# EAGLE design PCB (EAGLE 7.6.0)
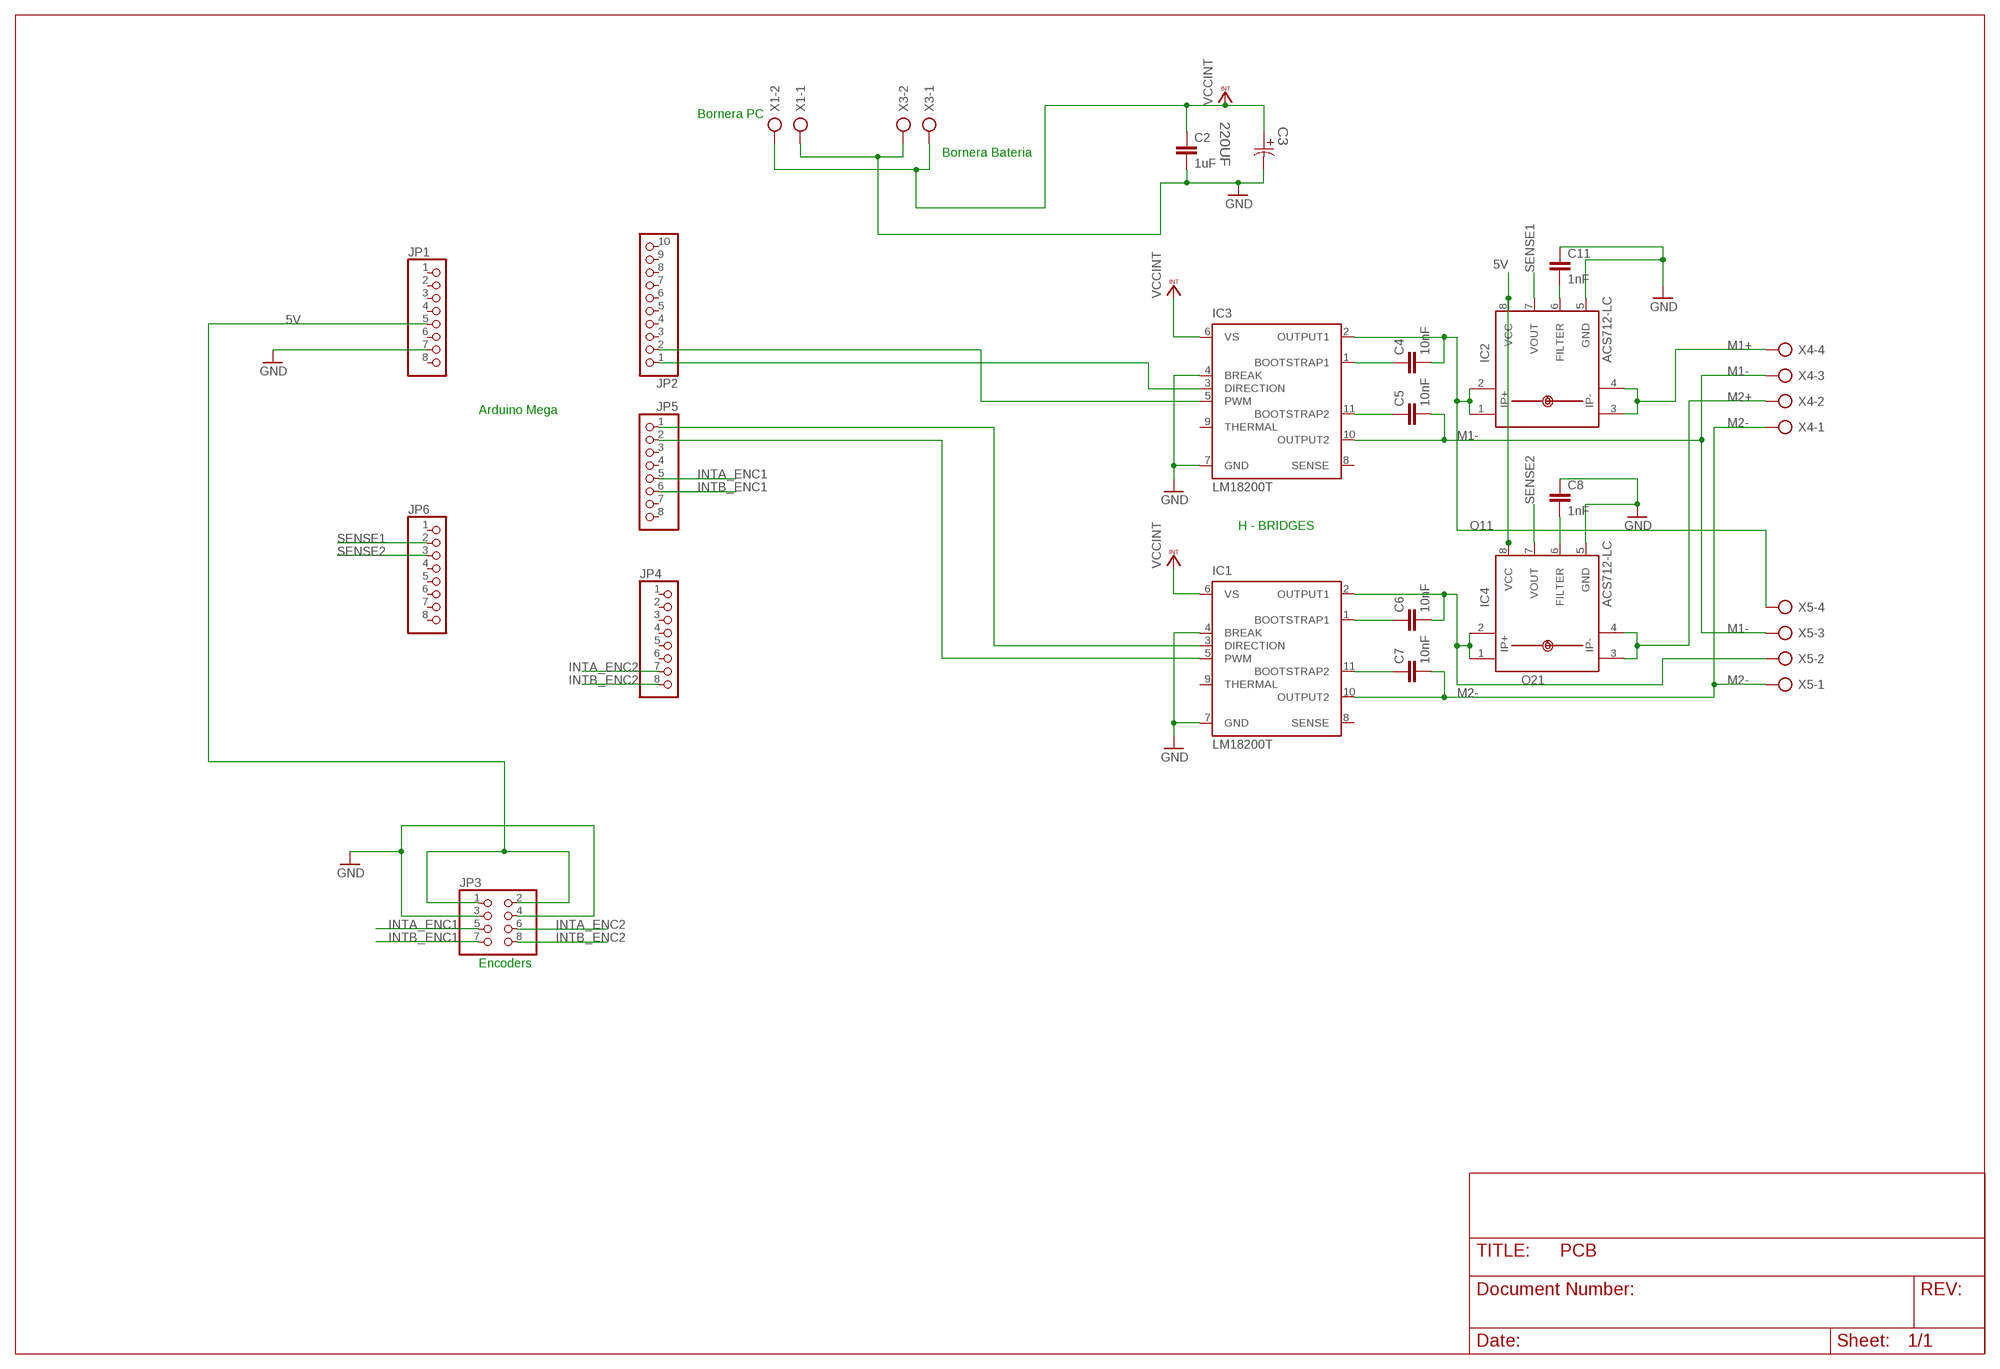
[diagram p0: schematic, sheet 1]

## Parts
C2  1uF  C-EU050-030X075  [C050-030X075]
C3  220UF  EEUFM1H221-P5.0-D10  [CAPPR500-1000X3200]
C4  10nF  C-EU050-030X075  [C050-030X075]
C5  10nF  C-EU050-030X075  [C050-030X075]
C6  10nF  C-EU050-030X075  [C050-030X075]
C7  10nF  C-EU050-030X075  [C050-030X075]
C8  1nF  C-EU050-030X075  [C050-030X075]
C11  1nF  C-EU050-030X075  [C050-030X075]
IC1  LM18200T  [TO-220-11]
IC2  ACS712-LC  [SOIC8]
IC3  LM18200T  [TO-220-11]
IC4  ACS712-LC  [SOIC8]
JP1  PINHD-1X8  [1X08]
JP2  PINHD-1X10  [1X10]
JP3  PINHD-2X4  [2X04]
JP4  PINHD-1X8  [1X08]
JP5  PINHD-1X8  [1X08]
JP6  PINHD-1X8  [1X08]
X1  AK500/2  [AK500/2]
X3  AK500/2  [AK500/2]
X4  AK500/4-H  [AK500/4-H]
X5  AK500/4-H  [AK500/4-H]

## Nets
5V: IC2.8(VCC) IC4.8(VCC) JP1.5 JP3.1 JP3.2
GND: C2.2 C3.2 C8.1 C11.1 IC1.4(BREAK) IC1.7(GND) IC2.5(GND) IC3.4(BREAK) IC3.7(GND) IC4.5(GND) JP1.7 JP3.3 JP3.4 X1.1 X3.2
INTA_ENC1: JP3.5 JP5.5
INTA_ENC2: JP3.6 JP4.7
INTB_ENC1: JP3.7 JP5.6
INTB_ENC2: JP3.8 JP4.8
M1+: IC2.3(IP-) IC2.4(IP-1) X4.4
M1-: C5.2 IC3.10(OUTPUT2) X4.3 X5.3
M2+: IC4.3(IP-) IC4.4(IP-1) X4.2
M2-: C7.2 IC1.10(OUTPUT2) X4.1 X5.1
N$1: IC3.3(DIRECTION) JP2.1
N$2: IC3.5(PWM) JP2.2
N$3: IC1.3(DIRECTION) JP5.1
N$4: C4.1 IC3.1(BOOTSTRAP1)
N$5: IC1.5(PWM) JP5.2
N$6: C8.2 IC4.6(FILTER)
N$13: C11.2 IC2.6(FILTER)
N$31: C5.1 IC3.11(BOOTSTRAP2)
N$32: C6.1 IC1.1(BOOTSTRAP1)
N$34: C7.1 IC1.11(BOOTSTRAP2)
O11: C4.2 IC2.1(IP+) IC2.2(IP+1) IC3.2(OUTPUT1) X5.4
O21: C6.2 IC1.2(OUTPUT1) IC4.1(IP+) IC4.2(IP+1) X5.2
SENSE1: IC2.7(VOUT) JP6.2
SENSE2: IC4.7(VOUT) JP6.3
VCCINT: C2.1 C3.1 IC1.6(VS) IC3.6(VS) X1.2 X3.1
Unconnected: IC1.8(SENSE) IC1.9(THERMAL) IC3.8(SENSE) IC3.9(THERMAL) JP1.1 JP1.2 JP1.3 JP1.4 JP1.6 JP1.8 JP2.3 JP2.4 JP2.5 JP2.6 JP2.7 JP2.8 JP2.9 JP2.10 JP4.1 JP4.2 JP4.3 JP4.4 JP4.5 JP4.6 JP5.3 JP5.4 JP5.7 JP5.8 JP6.1 JP6.4 JP6.5 JP6.6 JP6.7 JP6.8

## Notes on the sheet
- Bornera PC
- Bornera Bateria
- Arduino Mega
- H - BRIDGES
- Encoders

## Library data of the parts
C2 C4-C8 C11 = rcl:C-EU: CAPACITOR, European symbol
C3 = Panasonic-EE3:EEU: Aluminum Electrolytic Capacitors; MPN: EEUFM1H221; OC_FARNELL: 1219481; OC_NEWARK: 04M9023; RATEDVOLTAGE: 50V; SUPPLIER: PANASONIC; TOLERANCE: ±20 %
IC1 IC3 = national-semiconductor:LM18200T: 3A, 55V H-Bridge Motor Control SourcE: http://cache.national.com/ds/LM/LMD18200.pdf; OC_FARNELL: unknown; OC_NEWARK: unknown
IC2 IC4 = allegro-2:ACS712-LC
JP1 JP4-JP6 = pinhead:PINHD-1X8: PIN HEADER
JP2 = pinhead:PINHD-1X10: PIN HEADER
JP3 = pinhead:PINHD-2X4: PIN HEADER
X1 X3 = con-ptr500:AK500/2: CONNECTOR; OC_FARNELL: unknown; OC_NEWARK: unknown
X4 X5 = con-ptr500:AK500/4-H: CONNECTOR Aug. 2004 / PTR Meßtechnik: Die Bezeichnung der Serie AK505 wurde geändert. Es handelt sich hierbei um AK500 in horizontaler Ausführung.; OC_FARNELL: unknown; OC_NEWARK: unknown

## Board
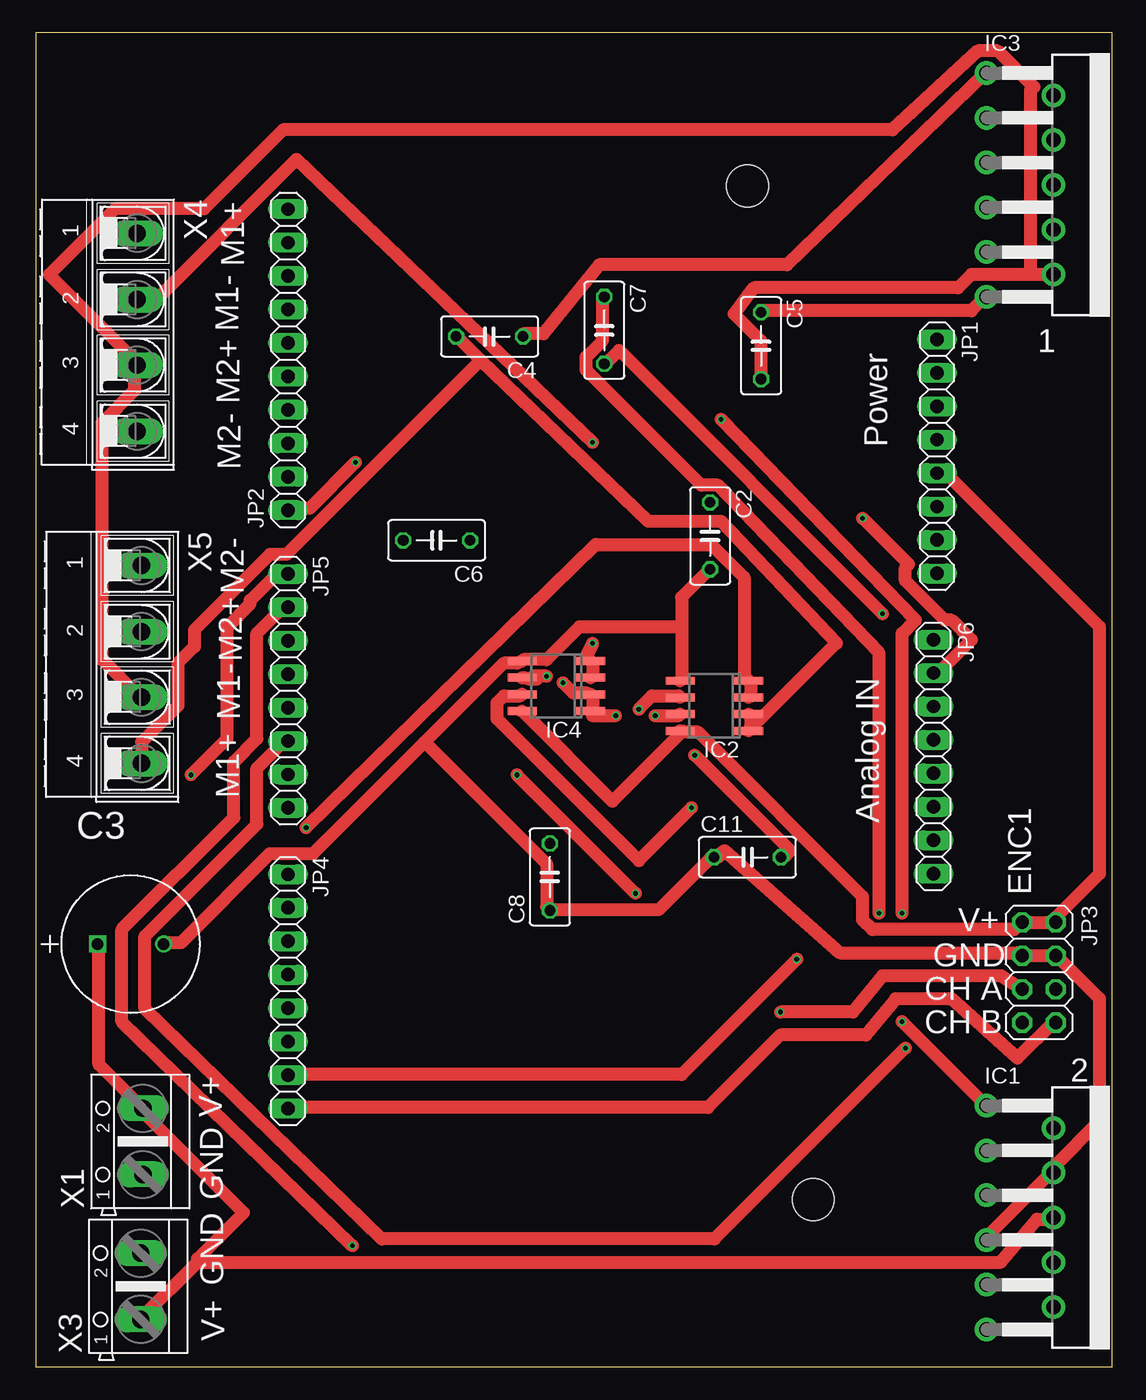
[diagram p1: board, top side]
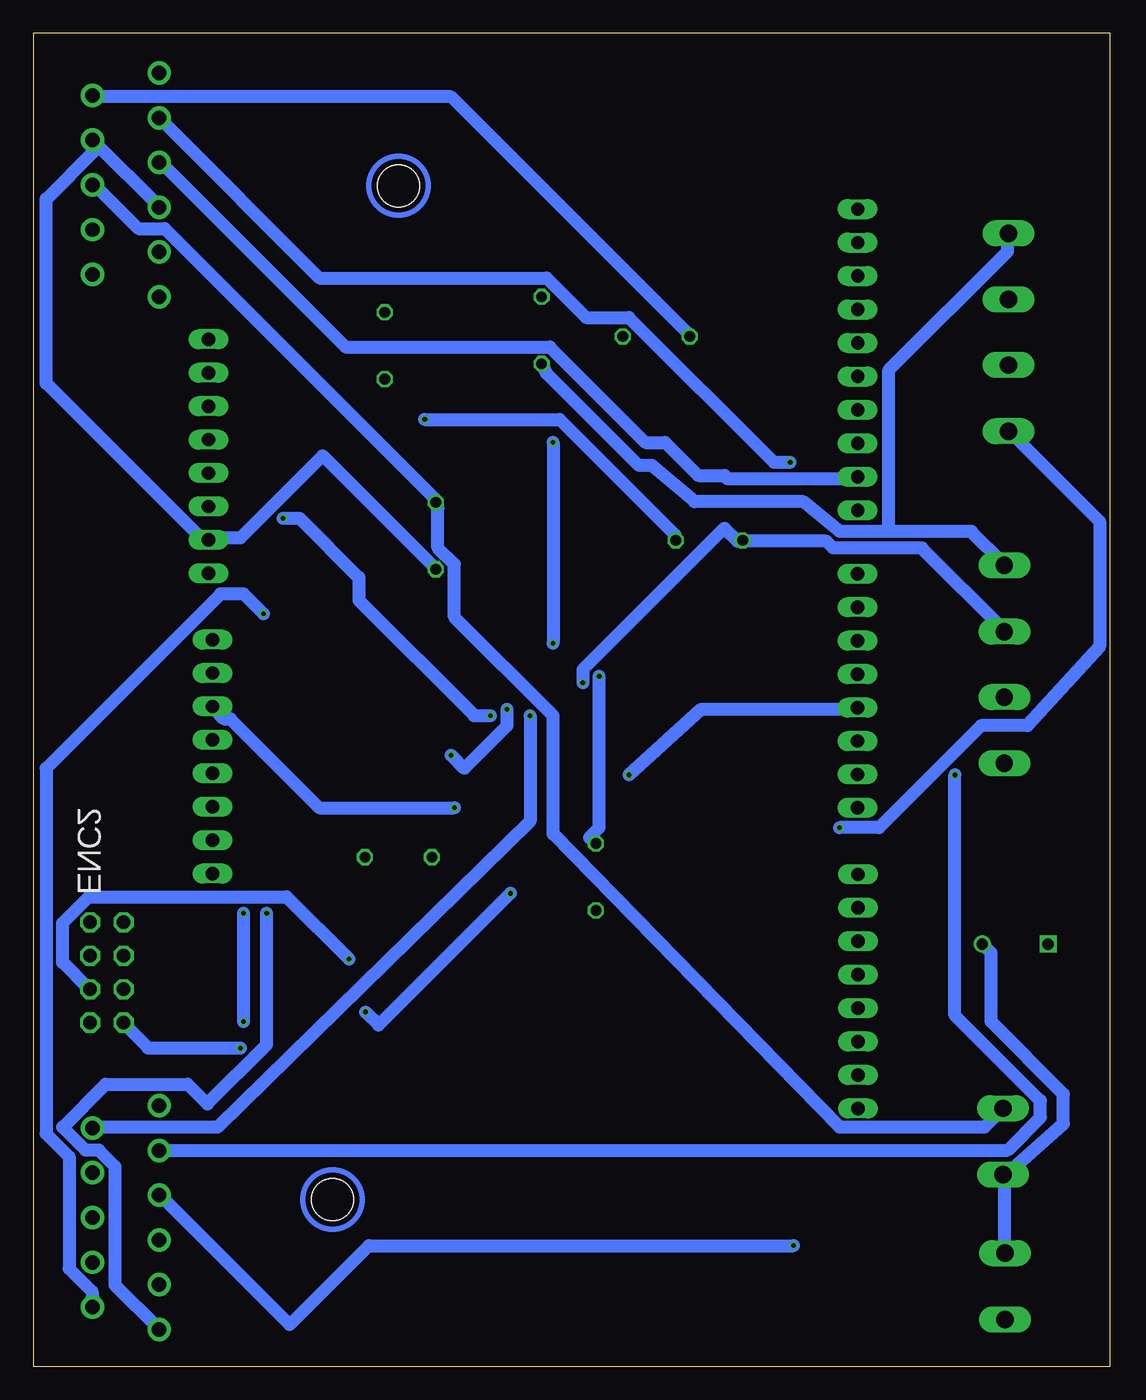
[diagram p2: board, bottom side, seen from below]

Size 81.7 x 101.3 mm. Coordinates in mm from the lower left corner, seen from the top.
Outline: 0,101.3 0,0 81.7,0 81.7,101.3 0,101.3
Copper layers (1+2*3+4*5+16): Top 0.018mm / dielectric 0.2mm / Route2 0.035mm / dielectric 0.36mm / Route3 0.035mm / dielectric 0.3mm / Route4 0.035mm / dielectric 0.36mm / Route5 0.035mm / dielectric 0.2mm / Bottom 0.018mm
Design rules "eC_6Layer_PClass6_BaseCopperO18-I35_eCDefault": minimum track width 0.15mm, minimum drill 0.35mm, track to track 0.15mm, track to pad 0.15mm, pad to pad 0.15mm, via to via 0.15mm, smd to smd 0mil, copper to edge 0.25mm, drill to drill 0.35mm, minimum pad ring 0.175mm, minimum via ring 0.125mm, stop-mask expansion 0mil, vias tented up to drill 0.45mm, thermal gap 0.2mm
Holes 3.2 mm at 59.02,12.69 54.02,89.69

### Footprints (pad centres in the part's own frame; a part is rotated, then mirrored left to right if it is on the bottom)
C050-030X075 = drill 0.813 octagon: 1 -2.54,0; 2 2.54,0
CAPPR500-1000X3200 = drill 0.864 square: 1 -5.004,0 | drill 0.864: 2 0,0
TO-220-11 = drill 1.1 pad 1.778: 1 -8.5,-9.37; 2 -6.8,-4.29; 3 -5.1,-9.37; 4 -3.4,-4.29; 5 -1.7,-9.37; 6 0,-4.29; 7 1.7,-9.37; 8 3.4,-4.29; 9 5.1,-9.37; 10 6.8,-4.29; 11 8.5,-9.37
SOIC8 = smd 0.6 x 2.2: 1 -1.905,-2.6; 2 -0.635,-2.6; 3 0.635,-2.6; 4 1.905,-2.6; 5 1.905,2.6; 6 0.635,2.6; 7 -0.635,2.6; 8 -1.905,2.6
1X08 = drill 1.016 long: 1 -8.89,0; 2 -6.35,0; 3 -3.81,0; 4 -1.27,0; 5 1.27,0; 6 3.81,0; 7 6.35,0; 8 8.89,0
1X10 = drill 1.016 long: 1 -11.43,0; 2 -8.89,0; 3 -6.35,0; 4 -3.81,0; 5 -1.27,0; 6 1.27,0; 7 3.81,0; 8 6.35,0; 9 8.89,0; 10 11.43,0
2X04 = drill 1.016 octagon: 1 -3.81,-1.27; 2 -3.81,1.27; 3 -1.27,-1.27; 4 -1.27,1.27; 5 1.27,-1.27; 6 1.27,1.27; 7 3.81,-1.27; 8 3.81,1.27
AK500/2 = drill 1.321 long: 1 -2.515,0; 2 2.515,0
AK500/4-H = drill 1.321 long: 1 -7.518,0; 2 -2.489,0; 3 2.489,0; 4 7.518,0

### Placement (x,y rotation side)
C2  51.18,63.1 270 top
C3  9.69,32.09 0 top
C4  34.44,78.24 180 top
C5  55.06,77.54 270 top
C6  30.42,62.76 180 top
C7  43.15,78.71 270 top
C8  39.02,37.19 90 top
C11  54.02,38.69 0 top
IC1  81.55,11.32 270 top
IC2  51.52,50.19 90 top
IC3  81.55,89.75 270 top
IC4  39.52,51.69 90 top
JP1  68.43,69.14 270 top
JP2  19.15,76.48 90 top
JP3  76.16,29.93 270 top
JP4  19.14,28.49 270 top
JP5  19.15,51.33 270 top
JP6  68.14,46.33 270 top
X1  8.12,17.1 90 top
X3  7.95,6.1 90 top
X4  7.68,78.56 270 top
X5  8.01,53.33 270 top

### Tracks (layer width: path | path; a pad name or v marks a point on that pad's centre or on a via)
5V
  Top 1: IC4.8 37.02,49.69 43.77,42.94 49.02,48.19 IC2.8 49.52,48.19 50.27,48.19 62.77,35.69 62.77,33.94 63.52,33.19 74.27,33.19 74.52,33.44 JP3.1 75.02,33.69 77.27,33.69 JP3.2 77.52,34.19 80.77,37.44 80.77,56.19 69.27,67.69 68.52,67.69 JP1.5
GND
  Top 1: IC1.7 72.27,9.69 72.27,9.94 77.02,14.69 IC1.4 77.27,15.19 80.77,18.69 80.77,27.94 77.77,30.94 JP3.4 77.27,31.19 75.02,31.19 JP3.3 74.52,31.44 61.02,31.44 52.27,39.19 51.77,38.69 C11.1 51.27,38.69 47.27,34.69 39.02,34.69 C8.1 38.77,34.94 38.77,38.19 29.52,47.44 | 49.02,56.19 49.02,58.44 51.02,60.44 C2.2 | 49.02,56.19 49.02,52.19 IC2.5 | 49.02,56.19 41.27,56.19 38.77,53.69 37.02,53.69 IC4.5 36.52,53.44 35.52,53.44 29.52,47.44 | 29.52,47.44 21.02,38.94 17.77,38.94 11.02,32.19 9.77,32.19 C3.2
  Bottom 1: C3.2 9.02,31.44 9.02,26.19 3.52,20.69 3.52,18.44 8.02,14.44 X1.1 8.02,13.94 8.02,8.69 X3.2 | IC3.7 72.27,88.19 77.02,92.94 IC3.4 77.02,92.44 80.77,88.69 80.77,74.69 68.77,62.69 JP1.7 68.27,62.94 66.02,62.94 59.77,69.19 51.27,60.69 C2.2
INTA_ENC1  (via drill 0.35)
  Top 1: v45.52,35.94 v36.52,44.94 | v56.52,26.94 62.02,26.94 64.27,29.69 73.27,29.69 74.77,28.69 JP3.5
  Bottom 1: v36.52,44.94 31.02,49.94 19.27,49.94 JP5.5 | v45.52,35.94 55.52,25.94 v56.52,26.94
INTA_ENC2  (via drill 0.35)
  Top 1: v57.77,30.94 49.02,22.19 19.27,22.19 JP4.7
  Bottom 1: v57.77,30.94 62.52,35.69 77.52,35.69 79.52,33.69 79.52,30.69 77.52,28.69 JP3.6
INTB_ENC1  (via drill 0.35)
  Top 1: v66.02,24.19 51.52,9.69 26.27,9.69 8.27,27.19 8.27,32.69 16.77,41.19 16.77,45.44 18.77,47.44 19.02,47.44 JP5.6
  Bottom 1: v66.02,24.19 73.02,24.19 74.77,25.94 JP3.7
INTB_ENC2
  Top 1: JP4.8 19.27,19.69 51.02,19.69 56.52,25.19 63.02,25.19 65.27,27.94 69.52,27.94 74.52,23.44 77.27,26.19 JP3.8
M1+  (via drill 0.35)
  Top 1: IC2.3 54.27,50.94 54.27,51.94 IC2.4 53.77,52.44 53.77,59.94 51.27,62.44 42.52,62.44 v20.52,40.94
  Bottom 1: v20.52,40.94 17.52,40.94 9.77,48.69 6.27,48.69 0.77,54.69 0.77,64.19 7.52,70.94 X4.4
M1-
  Top 1: X5.3 7.77,50.94 5.02,53.69 5.02,71.69 7.52,74.19 7.52,75.94 X4.3 7.52,76.44 1.02,82.94 6.02,87.94 12.77,87.94 18.77,93.94 65.02,93.94 71.52,99.94 73.02,99.94 75.77,97.19 75.52,96.94 75.52,82.94 | 75.52,82.94 77.02,82.94 IC3.10 | 75.52,82.94 71.02,82.94 70.02,81.94 54.52,81.94 53.02,79.94 55.02,77.94 55.02,75.19 C5.2
M2+  (via drill 0.35)
  Top 1: IC4.3 42.27,52.44 42.27,53.44 IC4.4 41.77,53.94 v42.27,54.94 | v42.27,70.19 19.77,91.69 9.27,81.19 X4.2
  Bottom 1: v42.27,70.19 v42.27,54.94
M2-  (via drill 0.35)
  Top 1: v64.27,57.19 44.27,77.19 43.27,76.19 C7.2
  Bottom 1: 16.77,63.44 10.52,63.44 8.02,60.94 X5.1 | 16.77,63.44 20.52,63.44 23.27,65.69 31.52,65.69 34.77,68.44 35.77,68.44 42.77,75.44 43.02,75.94 C7.2 | v64.27,57.19 65.77,58.69 67.52,58.69 80.77,45.44 80.77,17.69 79.02,15.94 79.02,7.44 77.27,5.69 77.27,4.69 IC1.10 | 16.77,63.44 16.77,75.69 7.77,84.69 7.77,85.94 X4.1
N$1  (via drill 0.35)
  Top 1: v24.27,68.69 20.77,65.19 19.27,65.19 JP2.1
  Bottom 1: v24.27,68.69 25.52,68.69 36.52,79.69 39.77,79.69 42.77,82.69 60.02,82.69 72.02,94.69 IC3.3
N$2
  Bottom 1: JP2.2 19.27,67.44 29.02,67.44 29.27,67.69 31.27,67.69 33.77,70.19 35.27,70.19 42.52,77.44 58.02,77.44 72.02,91.44 IC3.5
N$3  (via drill 0.35)
  Top 1: v11.77,44.94 14.52,47.69 14.52,56.19 16.27,57.94 16.27,58.19 18.27,60.19 19.02,60.19 JP5.1
  Bottom 1: v11.77,44.94 11.77,26.69 5.27,20.19 5.27,18.94 7.77,16.44 72.02,16.44 IC1.3
N$4
  Top 1: C4.1 37.02,78.44 38.52,78.44 42.77,83.69 57.02,83.69 72.02,98.19 IC3.1
N$5  (via drill 0.35)
  Top 1: v24.02,9.19 6.52,26.19 6.52,33.19 15.02,41.69 15.02,45.94 16.77,47.69 16.77,55.69 18.52,57.44 19.02,57.44 JP5.2
  Bottom 1: v24.02,9.19 56.27,9.19 62.27,3.19 72.02,12.94 IC1.5
N$6  (via drill 0.35)
  Top 1: v38.77,52.44 37.77,52.44 38.02,52.19 37.52,52.19 IC4.6
  Bottom 1: v38.77,52.44 38.77,40.94 39.52,40.19 39.02,39.69 C8.2
N$13  (via drill 0.35)
  Top 1: v45.77,49.94 46.77,50.94 48.77,50.94 IC2.6 | v50.02,46.44 57.27,39.19 56.77,38.69 C11.2
  Bottom 1: v45.77,49.94 45.77,48.69 49.02,45.44 v50.02,46.44
N$31
  Top 1: C5.1 55.27,80.19 71.02,80.19 72.02,81.19 IC3.11
N$32  (via drill 0.35)
  Top 1: v52.02,71.94 66.77,56.69 65.77,55.69 v65.77,34.44 | v65.77,26.19 72.02,19.94 IC1.1
  Bottom 1: v52.02,71.94 41.77,71.94 33.02,63.19 33.02,62.94 C6.1 | v65.77,26.19 v65.77,34.44
N$34  (via drill 0.35)
  Top 1: v64.02,34.44 64.02,54.19 51.77,66.94 50.52,66.94 41.77,75.69 41.77,76.69 43.02,77.94 43.02,81.19 C7.1
  Bottom 1: v64.02,34.44 64.02,24.44 68.52,19.94 70.02,21.44 76.27,21.44 79.52,18.19 77.77,16.44 76.77,16.44 75.52,15.19 75.52,6.19 72.27,2.94 IC1.11
O11
  Top 1: 54.27,48.69 54.27,49.44 IC2.2 | 54.27,48.69 54.27,48.44 IC2.1 | 33.77,76.44 46.52,64.19 52.02,64.19 60.77,54.94 54.52,48.69 54.27,48.69 | 33.77,76.44 32.02,78.19 C4.2 | 33.77,76.44 19.02,61.69 17.77,61.69 12.02,55.94 12.02,54.69 10.77,53.44 10.77,50.19 8.02,47.44 8.02,45.94 X5.4
  Bottom 1: IC3.2 77.02,96.44 50.02,96.44 32.02,78.44 C4.2
O21  (via drill 0.35)
  Top 1: v40.02,51.94 40.77,51.19 41.77,51.19 IC4.2 42.27,50.94 42.27,49.94 IC4.1 42.27,49.44 v44.02,49.44
  Bottom 1: X5.2 8.02,55.94 14.27,62.19 21.02,62.19 21.52,62.69 27.77,62.69 C6.2 28.27,62.69 29.27,63.69 40.02,52.94 v40.02,51.94 | v44.02,49.44 44.02,41.44 67.77,18.19 77.02,18.19 IC1.2
SENSE1  (via drill 0.35)
  Top 1: v47.02,49.44 48.77,49.44 IC2.7 | v62.77,64.44 66.27,60.94 66.02,60.69 66.02,59.69 69.02,56.69 69.52,56.69 71.02,55.19 68.27,52.44 JP6.2
  Bottom 1: v47.02,49.44 48.27,49.44 57.02,58.19 57.02,59.94 61.52,64.44 v62.77,64.44
SENSE2  (via drill 0.35)
  Top 1: v49.77,42.44 45.77,38.44 35.02,49.19 35.02,50.44 35.52,50.94 36.77,50.94 IC4.7
  Bottom 1: v49.77,42.44 60.02,42.44 66.77,49.19 67.27,49.19 68.02,49.94 JP6.3
VCCINT
  Top 1: C3.1 4.77,31.94 4.77,22.94 8.02,19.69 X1.2 8.27,19.19 15.77,11.69 12.27,8.19 12.27,7.94 | 12.27,7.94 73.27,7.94 76.02,11.19 77.02,11.19 IC1.6 | 12.27,7.94 8.02,3.69 X3.1
  Bottom 1: IC3.6 77.02,89.69 73.77,86.44 71.77,86.44 51.27,65.94 51.27,65.69 C2.1 51.02,65.19 51.02,62.19 49.77,60.94 49.77,56.94 42.27,49.44 42.27,40.44 20.52,18.19 9.52,18.19 8.27,19.44 X1.2
(copper drawn outside any net)
  shapes: Bottom circle x2

### Text on the board
tPlace: M1+ | M1- | 1 | M2+ | Power | M2- | M2- | M2+ | M1- | M1+ | Analog IN | ENC1 | V+ | GND | CH A | CH B | 2 | V+ | GND | GND | V+
bPlace: ENC2